# EAGLE design croky_b_1.7 mini (EAGLE 9.6.1)
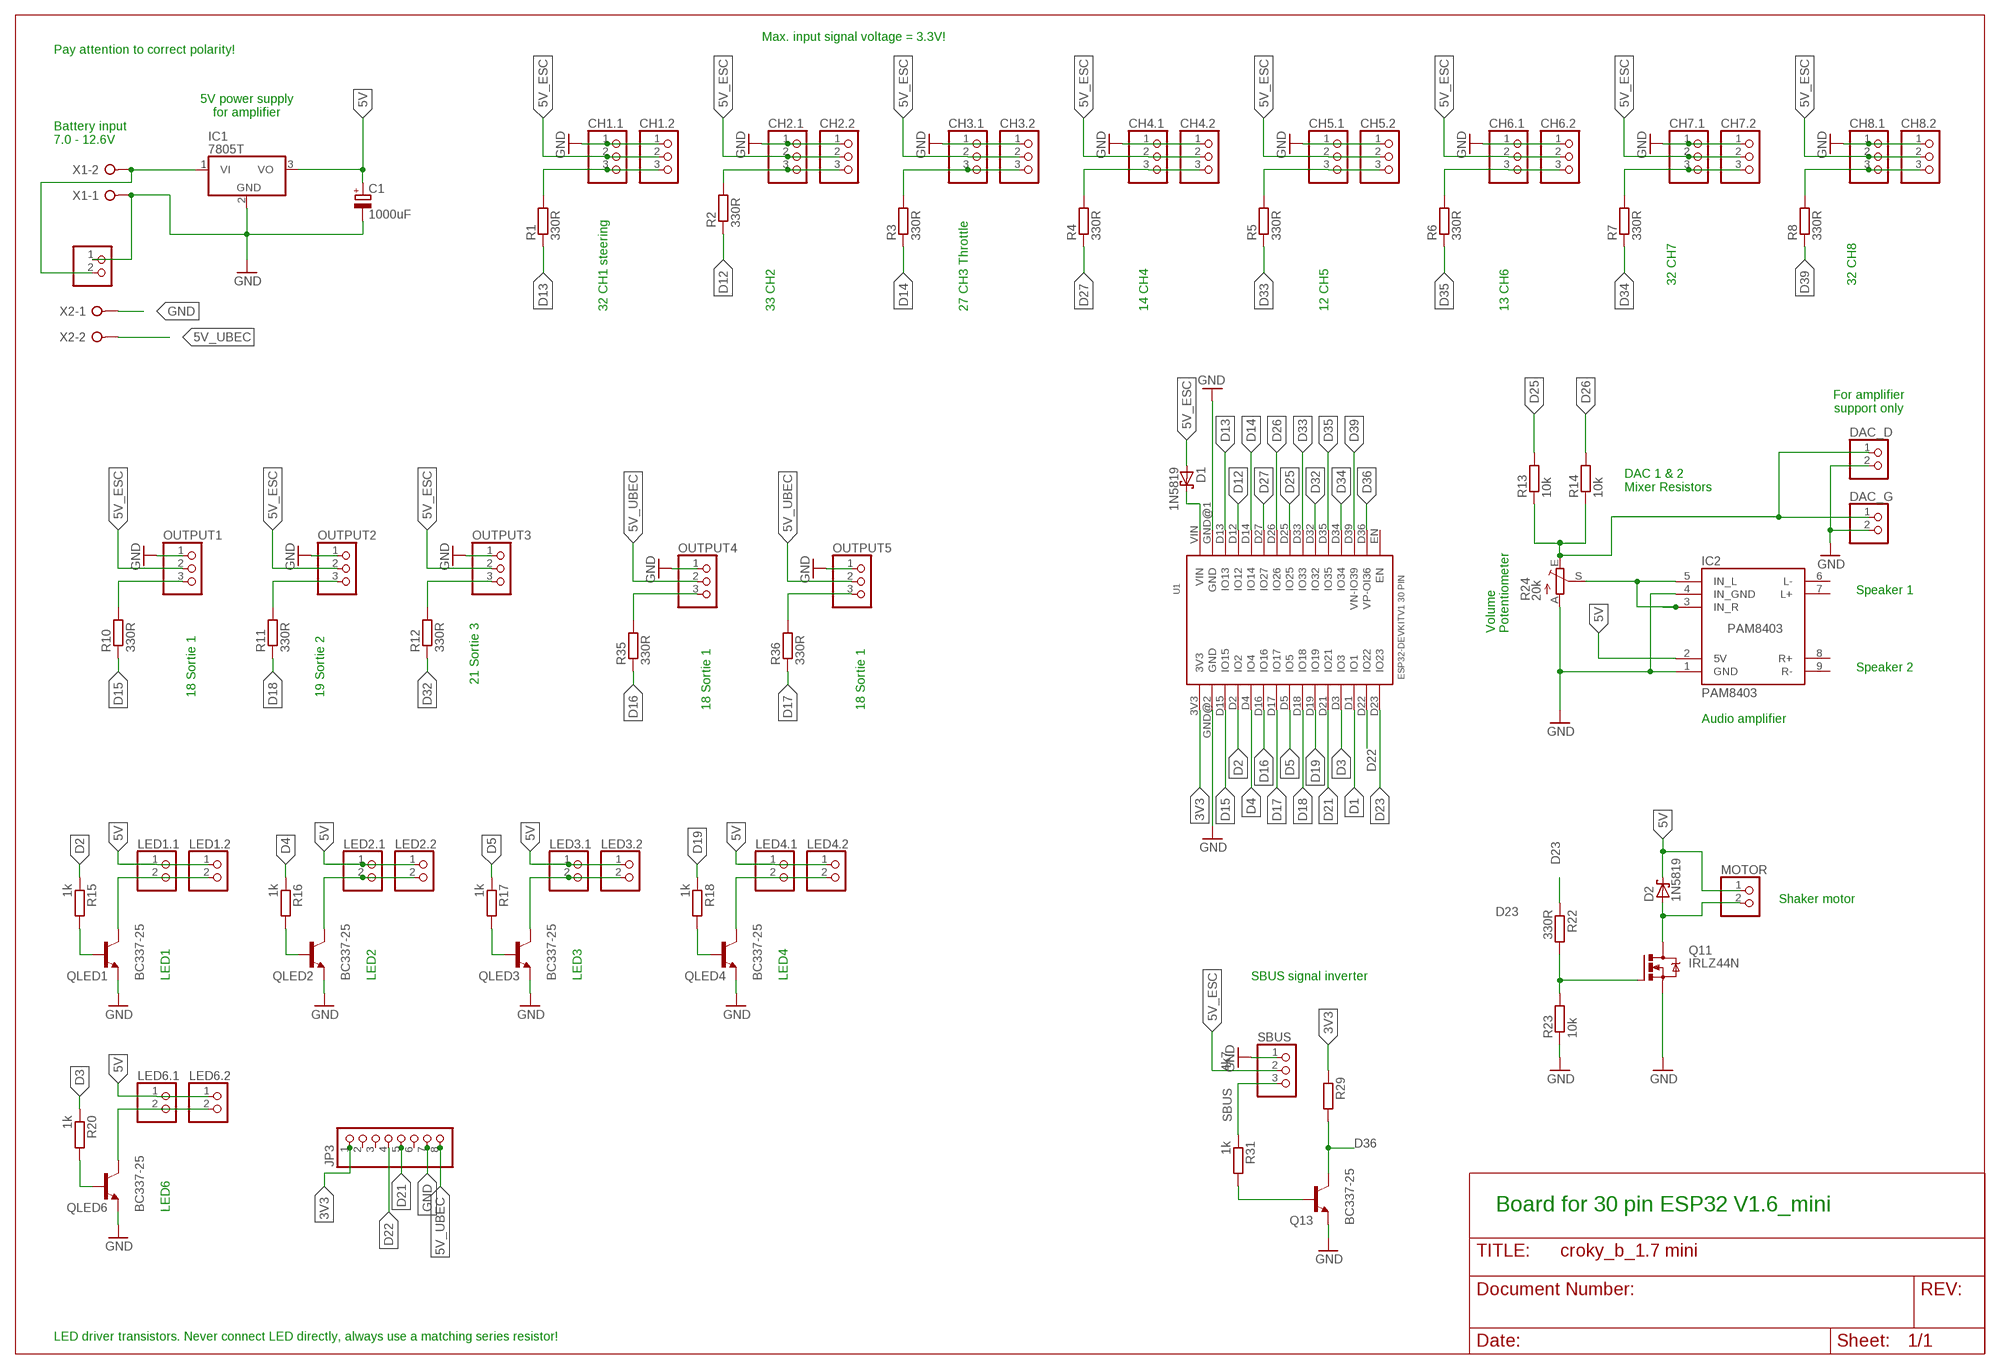
[diagram p0: schematic, sheet 1]

## Parts
C1  1000uF  CPOL-EUE5-10.5  [E5-10,5]
CH1.1  PINHD-1X3  [1X03]
CH1.2  PINHD-1X3  [1X03]
CH2.1  PINHD-1X3  [1X03]
CH2.2  PINHD-1X3  [1X03]
CH3.1  PINHD-1X3  [1X03]
CH3.2  PINHD-1X3  [1X03]
CH4.1  PINHD-1X3  [1X03]
CH4.2  PINHD-1X3  [1X03]
CH5.1  PINHD-1X3  [1X03]
CH5.2  PINHD-1X3  [1X03]
CH6.1  PINHD-1X3  [1X03]
CH6.2  PINHD-1X3  [1X03]
CH7.1  PINHD-1X3  [1X03]
CH7.2  PINHD-1X3  [1X03]
CH8.1  PINHD-1X3  [1X03]
CH8.2  PINHD-1X3  [1X03]
D1  1N5819  SCHOTTKY-DIODEDO35-7  [DO35-7]
D2  1N5819  SCHOTTKY-DIODEDO35-7  [DO35-7]
DAC_D  PINHD-1X2  [1X02]
DAC_G  PINHD-1X2  [1X02]
IC1  7805T  [TO220H]
IC2  PAM8403  [PAM8403]
JP3  PINHD-1X8  [1X08]
LED1.1  PINHD-1X2  [1X02]
LED1.2  PINHD-1X2  [1X02]
LED2.1  PINHD-1X2  [1X02]
LED2.2  PINHD-1X2  [1X02]
LED3.1  PINHD-1X2  [1X02]
LED3.2  PINHD-1X2  [1X02]
LED4.1  PINHD-1X2  [1X02]
LED4.2  PINHD-1X2  [1X02]
LED6.1  PINHD-1X2  [1X02]
LED6.2  PINHD-1X2  [1X02]
MOTOR  PINHD-1X2  [1X02]
MOTOR2  PINHD-1X2  [1X02]
OUTPUT1  PINHD-1X3  [1X03]
OUTPUT2  PINHD-1X3  [1X03]
OUTPUT3  PINHD-1X3  [1X03]
OUTPUT4  PINHD-1X3  [1X03]
OUTPUT5  PINHD-1X3  [1X03]
Q11  IRLZ44N  IRF540  [TO220BV]
Q13  BC337-25  [TO92]
QLED1  BC337-25  [TO92]
QLED2  BC337-25  [TO92]
QLED3  BC337-25  [TO92]
QLED4  BC337-25  [TO92]
QLED6  BC337-25  [TO92]
R1  330R  R-EU_0207/2V  [0207/2V]
R2  330R  R-EU_0207/2V  [0207/2V]
R3  330R  R-EU_0207/2V  [0207/2V]
R4  330R  R-EU_0207/2V  [0207/2V]
R5  330R  R-EU_0207/2V  [0207/2V]
R6  330R  R-EU_0207/2V  [0207/2V]
R7  330R  R-EU_0207/2V  [0207/2V]
R8  330R  R-EU_0207/2V  [0207/2V]
R10  330R  R-EU_0207/2V  [0207/2V]
R11  330R  R-EU_0207/2V  [0207/2V]
R12  330R  R-EU_0207/2V  [0207/2V]
R13  10k  R-EU_0207/10  [0207/10]
R14  10k  R-EU_0207/10  [0207/10]
R15  1k  R-EU_0207/2V  [0207/2V]
R16  1k  R-EU_0207/2V  [0207/2V]
R17  1k  R-EU_0207/2V  [0207/2V]
R18  1k  R-EU_0207/2V  [0207/2V]
R20  1k  R-EU_0207/2V  [0207/2V]
R22  330R  R-EU_0207/2V  [0207/2V]
R23  10k  R-EU_0207/2V  [0207/2V]
R24  20k  TRIM_EU-S64W  [S64W]
R29  4k7  R-EU_0207/2V  [0207/2V]
R31  1k  R-EU_0207/2V  [0207/2V]
R35  330R  R-EU_0207/2V  [0207/2V]
R36  330R  R-EU_0207/2V  [0207/2V]
SBUS  PINHD-1X3  [1X03]
U1  ESP32DEVKITV1  [ESP32-DEVKITV1]
X1  W237-02P  [W237-132]
X2  W237-02P  [W237-132]

## Nets
3V3: JP3.1 R29.1 U1.3V3
5V: C1.+ D2.C IC1.3(VO) IC2.2(5V) LED1.1.1 LED1.2.1 LED2.1.1 LED2.2.1 LED3.1.1 LED3.2.1 LED4.1.1 LED4.2.1 LED6.1.1 LED6.2.1 MOTOR.1
5V_ESC: CH1.1.2 CH1.2.2 CH2.1.2 CH2.2.2 CH3.1.2 CH3.2.2 CH4.1.2 CH4.2.2 CH5.1.2 CH5.2.2 CH6.1.2 CH6.2.2 CH7.1.2 CH7.2.2 CH8.1.2 CH8.2.2 D1.A OUTPUT1.2 OUTPUT2.2 OUTPUT3.2 SBUS.2
5V_UBEC: JP3.8 OUTPUT4.2 OUTPUT5.2 X2.2
-: LED2.1.2 LED2.2.2 QLED2.3(C)
--: LED3.1.2 LED3.2.2 QLED3.3(C)
BAT+: IC1.1(VI) MOTOR2.2 X1.2
D1: U1.D1(IO1)
D2: R15.1 U1.D2(IO2)
D3: R20.1 U1.D3(IO3)
D4: R16.1 U1.D4(IO4)
D5: R17.1 U1.D5(IO5)
D12: R2.1 U1.D12(IO12)
D13: R1.1 U1.D13(IO13)
D14: R3.1 U1.D14(IO14)
D15: R10.1 U1.D15(IO15)
D16: R35.1 U1.D16(IO16)
D17: R36.1 U1.D17(IO17)
D18: R11.1 U1.D18(IO18)
D19: R18.1 U1.D19(IO19)
D21: JP3.5 U1.D21(IO21)
D22: JP3.4 U1.D22(IO22)
D23: R22.1 U1.D23(IO23)
D25: R13.2 U1.D25(IO25)
D26: R14.2 U1.D26(IO26)
D27: R4.1 U1.D27(IO27)
D32: R12.1 U1.D32(IO32)
D33: R5.1 U1.D33(IO33)
D34: R7.1 U1.D34(IO34)
D35: R6.1 U1.D35(IO35)
D36: Q13.3(C) R29.2 U1.D36(VP-OI36)
D39: R8.1 U1.D39(VN-IO39)
GND: C1.- CH1.1.1 CH1.2.1 CH2.1.1 CH2.2.1 CH3.1.1 CH3.2.1 CH4.1.1 CH4.2.1 CH5.1.1 CH5.2.1 CH6.1.1 CH6.2.1 CH7.1.1 CH7.2.1 CH8.1.1 CH8.2.1 DAC_D.2 DAC_G.2 IC1.2(GND) IC2.1(GND) IC2.4(IN_GND) JP3.7 MOTOR2.1 OUTPUT1.1 OUTPUT2.1 OUTPUT3.1 OUTPUT4.1 OUTPUT5.1 Q11.S Q13.1(E) QLED1.1(E) QLED2.1(E) QLED3.1(E) QLED4.1(E) QLED6.1(E) R23.1 R24.A SBUS.1 U1.GND@1(GND) U1.GND@2(GND) X1.1 X2.1
N$1: IC2.3(IN_R) IC2.5(IN_L) R24.S
N$3: CH6.1.3 CH6.2.3 R6.2
N$4: Q11.G R22.2 R23.2
N$5: CH5.1.3 CH5.2.3 R5.2
N$6: CH4.1.3 CH4.2.3 R4.2
N$7: CH7.1.3 CH7.2.3 R7.2
N$8: CH3.1.3 CH3.2.3 R3.2
N$9: D1.C U1.VIN
N$10: CH1.1.3 CH1.2.3 R1.2
N$11: OUTPUT1.3 R10.2
N$12: OUTPUT2.3 R11.2
N$13: OUTPUT3.3 R12.2
N$14: CH2.1.3 CH2.2.3 R2.2
N$15: D2.A MOTOR.2 Q11.D
N$16: QLED1.2(B) R15.2
N$17: QLED6.2(B) R20.2
N$18: LED1.1.2 LED1.2.2 QLED1.3(C)
N$19: LED6.1.2 LED6.2.2 QLED6.3(C)
N$20: DAC_D.1 DAC_G.1 R13.1 R14.1 R24.E
N$22: QLED3.2(B) R17.2
N$24: QLED2.2(B) R16.2
N$29: QLED4.2(B) R18.2
N$30: LED4.1.2 LED4.2.2 QLED4.3(C)
N$37: Q13.2(B) R31.2
N$41: CH8.1.3 CH8.2.3 R8.2
N$49: OUTPUT4.3 R35.2
N$50: OUTPUT5.3 R36.2
SBUS: R31.1 SBUS.3
Unconnected: IC2.6(L-) IC2.7(L+) IC2.8(R+) IC2.9(R-) JP3.2 JP3.3 JP3.6 U1.EN

## Notes on the sheet
- Max. input signal voltage = 3.3V!
- Pay attention to correct polarity!
- 5V power supply
  for amplifier
- Battery input
  7.0 - 12.6V
- 32 CH7 | 32 CH8
- 32 CH1 steering | 33 CH2 | 27 CH3 Throttle | 14 CH4 | 12 CH5 | 13 CH6
- For amplifier
  support only
- DAC 1 & 2
  Mixer Resistors
- Speaker 1
- Volume
  Potentiometer
- Speaker 2
- 21 Sortie 3
- 18 Sortie 1 | 19 Sortie 2
- 18 Sortie 1 | 18 Sortie 1
- Audio amplifier
- Shaker motor
- LED1 | LED2 | LED3 | LED4 | SBUS signal inverter
- LED6 | Board for 30 pin ESP32 V1.6_mini
- LED driver transistors. Never connect LED directly, always use a matching series resistor!

## Library data of the parts
C1 = rcl:CPOL-EU: POLARIZED CAPACITOR, European symbol
CH1.1 CH1.2 CH2.1 CH2.2 CH3.1 CH3.2 CH4.1 CH4.2 CH5.1 CH5.2 CH6.1 CH6.2 CH7.1 CH7.2 CH8.1 CH8.2 OUTPUT1-OUTPUT5 SBUS = 00_custom_pinhead:PINHD-1X3: PIN HEADER
D1 D2 = diode:SCHOTTKY-DIODE: Schottky Diode
DAC_D DAC_G LED1.1 LED1.2 LED2.1 LED2.2 LED3.1 LED3.2 LED4.1 LED4.2 LED6.1 LED6.2 MOTOR MOTOR2 = 00_custom_pinhead:PINHD-1X2: PIN HEADER
IC1 = linear:78*: Positive VOLTAGE REGULATOR Source: http://cache.national.com/ds/LM/LM78L05.pdf http://www.fairchildsemi.com/ds/LM/LM7805.pdf
IC2 = 00_custom:PAM8403: 2Channel 3W DC 2.5-5V Class D Amplifier Board
JP3 = pinhead:PINHD-1X8: PIN HEADER
Q11 = transistor-power:IRF540: HEXFET Power MOSFET
Q13 QLED1-QLED4 QLED6 = transistor-npn:BC337*: NPN Transistor
R1 R2 R4-R8 R10-R18 R20 R22 R23 R29 R31 R35 R36 = rcl:R-EU_: RESISTOR, European symbol
R3 = rcl:R-EU_: RESISTOR, European symbol; SPICEPREFIX: R
R24 = pot:TRIM_EU-: POTENTIOMETER
U1 = ESP32-DEVKITV1_30pin:ESP32DEVKITV1
X1 X2 = con-wago-508:W237-02P: WAGO SREW CLAMP; OC_FARNELL: unknown; OC_NEWARK: unknown

## Net classes
0 5V: clearance 0.254 mm

## Board
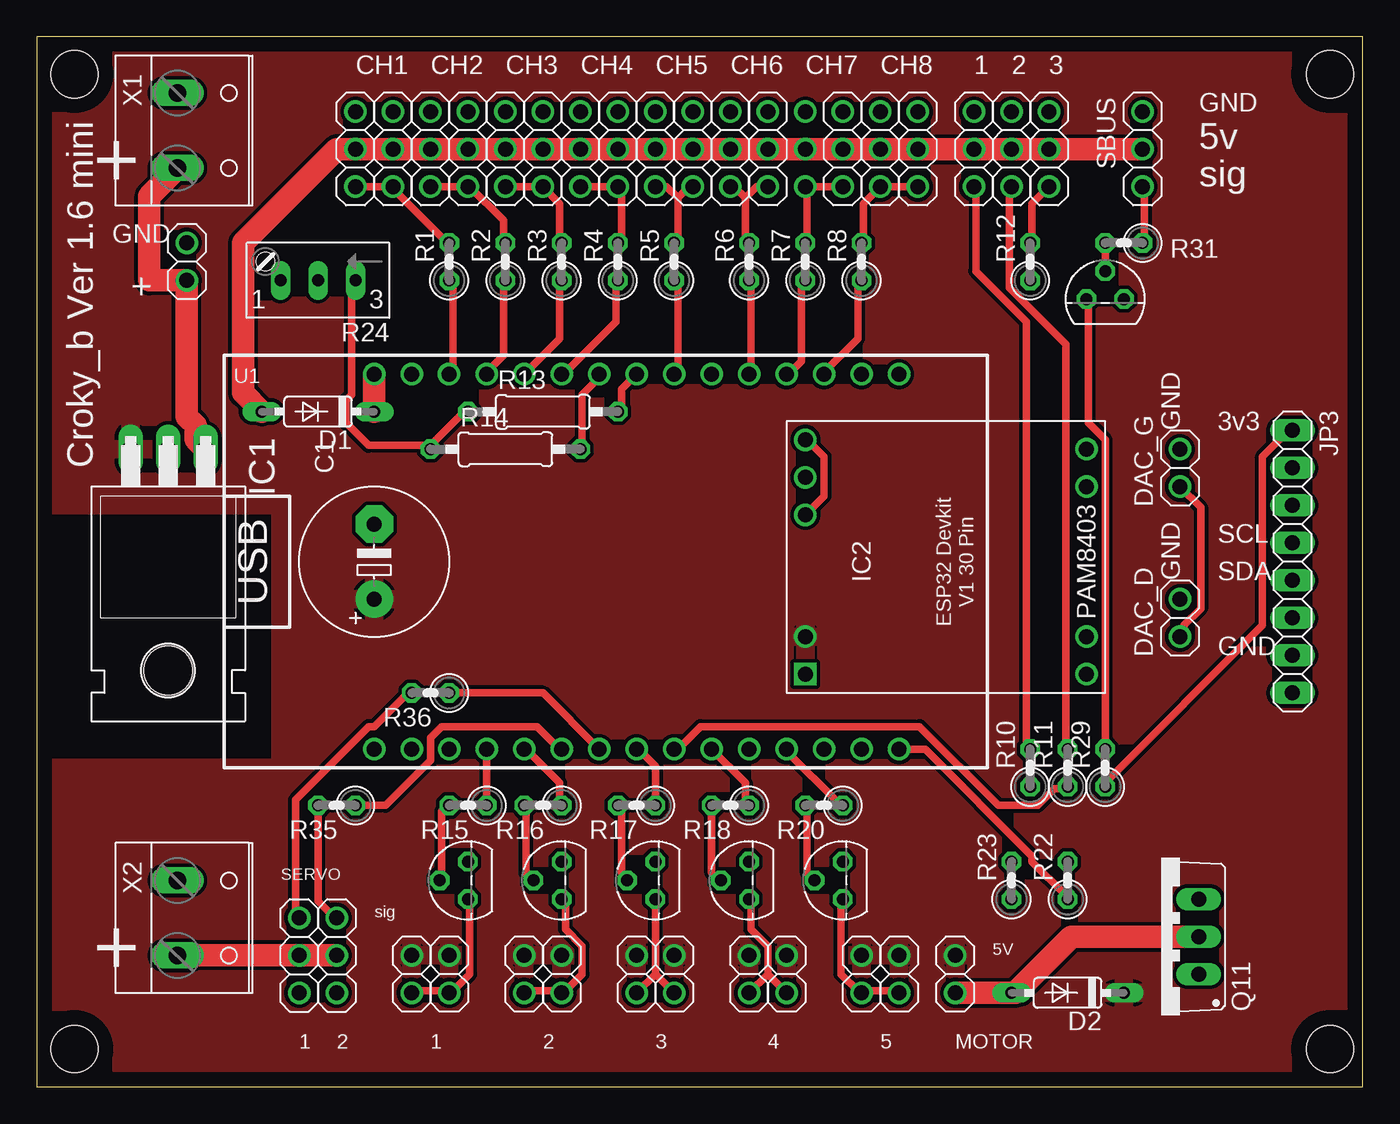
[diagram p1: board, top side]
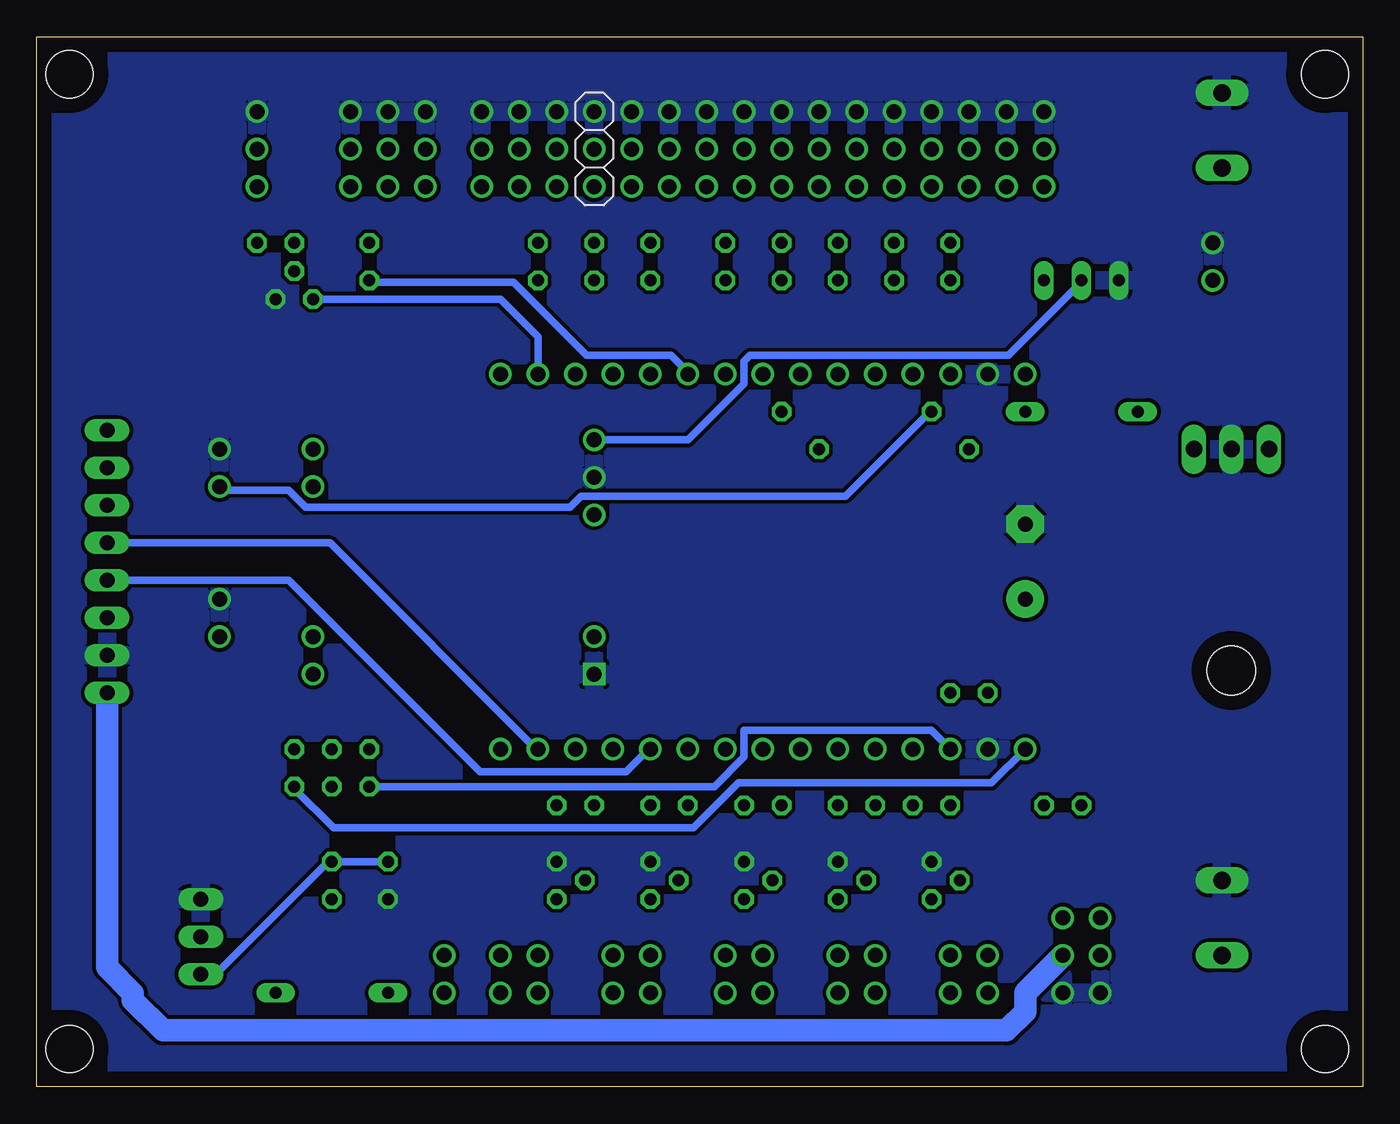
[diagram p2: board, bottom side, seen from below]

Size 89.84 x 71.11 mm. Coordinates in mm from the lower left corner, seen from the top.
Outline: 0,0 89.84,0 89.84,71.11 0,71.11 0,0
Copper layers (1*16): Top 0.035mm / dielectric 1.5mm / Bottom 0.035mm
Design rules "default *": minimum track width 20mil, minimum drill 0.35mm, track to track 6mil, track to pad 6mil, pad to pad 6mil, via to via 6mil, smd to smd 6mil, copper to edge 40mil, drill to drill 6mil, minimum pad ring 10mil, minimum via ring 8mil, stop-mask expansion 4mil, vias tented up to drill 0mil, thermal gap 10mil
Holes 3.2 mm at 2.54,68.58 2.54,68.58 2.54,2.54 2.54,2.54 87.63,2.54 87.63,2.54 87.63,68.58 87.63,68.58

### Footprints (pad centres in the part's own frame; a part is rotated, then mirrored left to right if it is on the bottom)
E5-10,5 = drill 1.016 pad 2.54: + -2.54,0 | drill 1.016 pad 2.54 octagon: - 2.54,0
1X03 = drill 1.016 pad 1.524: 1 -2.54,0; 2 0,0; 3 2.54,0
DO35-7 = drill 0.813 long: A 3.81,0; C -3.81,0
1X02 = drill 1.016 pad 1.524: 1 -1.27,0; 2 1.27,0
TO220H = drill 1.118 long: 1 -2.54,-10.16; 2 0,-10.16; 3 2.54,-10.16 | hole 3.302: 0,4.826
PAM8403 = drill 1.016 square: 1 -7.62,8.89 | drill 1.016: 2 -5.08,8.89; 3 3.175,8.89; 4 5.715,8.89; 5 8.255,8.89; 6 7.62,-10.16; 7 5.08,-10.16; 8 -5.08,-10.16; 9 -7.62,-10.16
1X08 = drill 1.016 long: 1 -8.89,0; 2 -6.35,0; 3 -3.81,0; 4 -1.27,0; 5 1.27,0; 6 3.81,0; 7 6.35,0; 8 8.89,0
TO220BV = drill 1.016 long: D 0,-2.54; G -2.54,-2.54; S 2.54,-2.54
TO92 = drill 0.813 octagon: 1 1.27,0; 2 0,1.905; 3 -1.27,0
0207/2V = drill 0.813 octagon: 1 -1.27,0; 2 1.27,0
0207/10 = drill 0.813 octagon: 1 -5.08,0; 2 5.08,0
S64W = drill 0.813 long: A 2.54,1.27; E -2.54,1.27; S 0,1.27
ESP32-DEVKITV1 = drill 1.016: 3V3 -16.51,-12.7; D1 13.97,-12.7; D2 -8.89,-12.7; D3 11.43,-12.7; D4 -6.35,-12.7; D5 1.27,-12.7; D12 -8.89,12.7; D13 -11.44,12.7; D14 -6.35,12.7; D15 -11.43,-12.7; D16 -3.81,-12.7; D17 -1.27,-12.7; D18 3.81,-12.7; D19 6.35,-12.7; D21 8.89,-12.7; D22 16.51,-12.7; D23 19.05,-12.7; D25 1.27,12.7; D26 -1.27,12.7; D27 -3.81,12.7; D32 6.35,12.7; D33 3.81,12.7; D34 11.43,12.7; D35 8.89,12.7; D36 16.51,12.7; D39 13.97,12.7; EN 19.05,12.7; GND@1 -13.97,12.7; GND@2 -13.97,-12.7; VIN -16.51,12.7
W237-132 = drill 1.194 long: 1 -2.54,-0.635; 2 2.54,-0.635

### Placement (x,y rotation side)
C1  22.86,35.56 90 top
CH1.1  21.59,63.5 270 top
CH1.2  24.13,63.5 270 top
CH2.1  26.67,63.5 270 top
CH2.2  29.21,63.5 270 top
CH3.1  31.75,63.5 270 top
CH3.2  34.29,63.5 270 top
CH4.1  36.83,63.5 270 top
CH4.2  39.37,63.5 270 top
CH5.1  41.91,63.5 270 top
CH5.2  44.45,63.5 270 top
CH6.1  46.99,63.5 270 top
CH6.2  49.53,63.5 270 top
CH7.1  52.07,63.5 270 bottom
CH7.2  54.61,63.5 270 top
CH8.1  57.15,63.5 270 top
CH8.2  59.69,63.5 270 top
D1  19.05,45.72 180 top
D2  69.85,6.35 180 top
DAC_D  77.47,31.75 90 top
DAC_G  77.47,41.91 90 top
IC1  8.89,33.02 180 top
IC2  60.96,35.56 90 top
JP3  85.09,35.56 270 top
LED1.1  27.94,7.62 270 top
LED1.2  25.4,7.62 270 top
LED2.1  33.02,7.62 270 top
LED2.2  35.56,7.62 270 top
LED3.1  40.64,7.62 270 top
LED3.2  43.18,7.62 270 top
LED4.1  48.26,7.62 270 top
LED4.2  50.8,7.62 270 top
LED6.1  55.88,7.62 270 top
LED6.2  58.42,7.62 270 top
MOTOR  62.23,7.62 270 top
MOTOR2  10.16,55.88 270 top
OUTPUT1  63.5,63.5 270 top
OUTPUT2  66.04,63.5 270 top
OUTPUT3  68.58,63.5 270 top
OUTPUT4  20.32,8.89 90 top
OUTPUT5  17.78,8.89 90 top
Q11  76.2,10.16 90 top
Q13  72.39,53.34 0 top
QLED1  29.21,13.97 90 top
QLED2  35.56,13.97 90 top
QLED3  41.91,13.97 90 top
QLED4  48.26,13.97 90 top
QLED6  54.61,13.97 90 top
R1  27.94,55.88 90 top
R2  31.75,55.88 90 top
R3  35.56,55.88 90 top
R4  39.37,55.88 90 top
R5  43.18,55.88 90 top
R6  48.26,55.88 90 top
R7  52.07,55.88 90 top
R8  55.88,55.88 90 top
R10  67.31,21.59 90 top
R11  69.85,21.59 90 top
R12  67.31,55.88 90 top
R13  34.29,45.72 0 top
R14  31.75,43.18 0 top
R15  29.21,19.05 180 top
R16  34.29,19.05 180 top
R17  40.64,19.05 180 top
R18  46.99,19.05 180 top
R20  53.34,19.05 180 top
R22  69.85,13.97 90 top
R23  66.04,13.97 90 top
R24  19.05,55.88 180 top
R29  72.39,21.59 90 top
R31  73.66,57.15 180 top
R35  20.32,19.05 180 top
R36  26.67,26.67 180 top
SBUS  74.93,63.5 270 top
U1  39.37,35.56 0 top
X1  10.16,64.77 270 top
X2  10.16,11.43 270 top

### Tracks (layer width: path | path; a pad name or v marks a point on that pad's centre or on a via)
3V3
  Top 0.508: R29.1 72.39,20.57 83.06,31.24 83.06,42.67 84.84,44.45 JP3.1
  Bottom 0.508: U1.3V3 25.15,20.57 42.29,20.57 45.34,17.53 69.72,17.53 72.39,20.19 R29.1
5V
  pour Top: 0,72.39 95.25,72.39 95.25,1.27 0,1.27 0,21.59 16.51,21.59 16.51,39.37 0,39.37
5V_ESC
  Top 1.524: D1.A 13.97,46.99 13.97,57.15 20.32,63.5 CH1.1.2 CH1.2.2 CH2.1.2 CH2.2.2 CH3.1.2 CH3.2.2 CH4.1.2 CH4.2.2 CH5.1.2 CH5.2.2 CH6.1.2 CH6.2.2 CH7.1.2 CH7.2.2 CH8.1.2 CH8.2.2 OUTPUT1.2 OUTPUT2.2 OUTPUT3.2 SBUS.2
5V_UBEC
  Top 1.524: OUTPUT4.2 OUTPUT5.2 X2.2
  Bottom 1.524: OUTPUT4.2 22.86,6.35 22.86,5.08 24.13,3.81 81.28,3.81 83.33,5.86 83.33,6.33 85.09,8.09 JP3.8
-
  Top 0.508: QLED2.3 35.81,12.57 35.81,10.67 36.96,9.53 36.96,7.62 35.81,6.48 LED2.2.2 35.43,6.48 33.15,6.48 LED2.1.2
--
  Top 0.508: 41.91,7.62 QLED3.3 | LED3.1.2 41.91,7.62 | 41.91,7.62 LED3.2.2
BAT+
  Top 1.524: IC1.1 10.74,43.87 10.74,44.79 10.16,45.37 MOTOR2.2 7.62,54.61 7.62,60.33 X1.2
D2
  Top 0.508: U1.D2 R15.1
D3
  Top 0.508: R20.1 54.48,19.05 50.67,22.86 U1.D3
D4
  Top 0.508: R16.1 35.43,19.05 35.43,20.57 33.15,22.86 U1.D4
D5
  Top 0.508: R17.1 41.91,21.72 40.77,22.86 U1.D5
D12
  Top 0.508: R2.1 31.62,54.48 31.62,49.53 30.48,48.39 U1.D12
D13
  Top 0.508: R1.1 28.19,54.48 28.19,48.39 U1.D13
D14
  Top 0.508: U1.D14 35.43,50.67 35.43,54.48 R3.1
D15
  Bottom 0.508: U1.D15 29.21,24.13 41.91,24.13 41.91,22.33 43.92,20.32 R10.1
D16
  Top 0.508: R35.1 23.62,19.05 26.67,22.1 26.67,23.62 27.43,24.38 33.91,24.38 35.43,22.86 U1.D16
D17
  Top 0.508: R36.1 34.29,26.67 U1.D17
D18
  Top 0.508: R11.1 69.72,20.19 68.96,20.19 67.82,19.05 65.15,19.05 59.82,24.38 44.96,24.38 43.43,22.86 U1.D18
D19
  Top 0.508: U1.D19 48.01,20.57 48.01,19.05 R18.1
D21
  Bottom 0.508: U1.D21 48.39,22.86 49.91,21.34 59.82,21.34 72.77,34.29 JP3.5
D22
  Bottom 0.508: U1.D22 56.01,22.86 69.98,36.83 JP3.4
D23
  Top 0.508: U1.D23 60.2,22.86 67.44,15.62 67.44,15.24 69.72,12.95 R22.1
D25
  Top 0.508: U1.D25 39.62,47.24 39.62,45.72 R13.2
D26
  Top 0.508: R14.2 36.96,43.43 36.96,46.86 38.1,48.01 U1.D26
D27
  Top 0.508: R4.1 39.24,54.48 39.24,51.82 35.81,48.39 U1.D27
D32
  Bottom 0.508: R12.1 67.06,54.48 57.53,54.48 52.58,49.53 46.86,49.53 45.72,48.39 U1.D32
D33
  Top 0.508: R5.1 43.43,54.48 43.43,48.39 U1.D33
D34
  Top 0.508: R7.1 51.82,54.48 51.82,49.15 51.05,48.39 U1.D34
D35
  Top 0.508: R6.1 48.39,54.48 48.39,48.39 U1.D35
D36
  Top 0.508: R29.2 72.39,43.81 71.25,44.96 71.25,53.34 Q13.3
  Bottom 0.508: U1.D36 55.88,50.8 58.42,53.34 Q13.3
D39
  Top 0.508: R8.1 55.63,54.48 55.63,50.67 53.34,48.39 U1.D39
GND
  pour Bottom: 0,72.39 0,-2.54 93.98,-2.54 93.98,72.39
N$1
  Top 0.508: IC2.3 53.34,40 53.34,42.67 52.2,43.81 IC2.5
  Bottom 0.508: IC2.5 45.72,43.81 41.91,47.62 41.91,49.15 41.53,49.53 24,49.53 19.05,54.48 R24.S
N$3
  Top 0.508: 48.01,60.2 48.01,57.15 R6.2 | 48.01,60.2 47.24,60.96 CH6.1.3 | CH6.2.3 48.77,60.96 48.01,60.2
N$4
  Bottom 0.508: R23.2 R22.2 70.1,15.24 77.72,7.62 Q11.G
N$5
  Top 0.508: 43.43,60.2 43.43,57.15 R5.2 | 43.43,60.2 44.2,60.96 CH5.2.3 | CH5.1.3 42.67,60.96 43.43,60.2
N$6
  Top 0.508: R4.2 39.62,57.15 39.62,60.96 CH4.2.3 CH4.1.3
N$7
  Top 0.508: 52.2,60.96 52.2,57.15 R7.2 | 52.2,60.96 CH7.2.3 | 52.2,60.96 CH7.1.3
N$8
  Top 0.508: R3.2 35.43,57.15 35.43,59.82 CH3.2.3 CH3.1.3
N$9
  Top 1.524: U1.VIN D1.C
N$10
  Top 0.508: 24,60.96 27.81,57.15 R1.2 | 24,60.96 CH1.1.3 | 24,60.96 CH1.2.3
N$11
  Top 0.508: R10.2 67.06,22.86 67.06,51.82 63.63,55.24 63.63,60.96 OUTPUT1.3
N$12
  Top 0.508: R11.2 69.72,22.86 69.72,50.29 65.91,54.1 65.91,60.96 OUTPUT2.3
N$13
  Top 0.508: OUTPUT3.3 67.44,59.82 67.44,57.15 R12.2
N$14
  Top 0.508: R2.2 31.62,57.15 31.62,58.67 29.34,60.96 CH2.2.3 CH2.1.3
N$15
  Top 0.508: 69.85,9.91 78.49,9.91 Q11.D
  Top 1.524: MOTOR.2 D2.A 66.29,6.35 69.85,9.91 70.1,10.16 Q11.D
N$16
  Top 0.508: QLED1.2 27.43,14.1 27.43,18.67 27.81,19.05 R15.2
N$17
  Top 0.508: QLED6.2 52.2,14.48 52.2,19.05 R20.2
N$18
  Top 0.508: QLED1.3 29.34,12.57 29.34,7.62 28.19,6.48 LED1.1.2 27.81,6.48 25.53,6.48 LED1.2.2
N$19
  Top 0.508: QLED6.3 54.48,12.57 54.48,7.62 55.63,6.48 LED6.1.2 56.01,6.48 58.29,6.48 LED6.2.2
N$20
  Top 0.508: DAC_G.1 78.87,39.24 78.87,32.38 77.72,31.24 77.72,30.48 DAC_D.1 | 26.67,43.43 28.96,45.72 R13.1 | 26.67,43.43 22.48,43.43 20.95,44.96 20.95,46.48 21.34,46.86 21.34,54.48 R24.E | 26.67,43.43 R14.1
  Bottom 0.508: DAC_G.1 77.34,40.39 72.77,40.39 71.63,39.24 53.72,39.24 52.96,40 35.05,40 29.34,45.72 R13.1
N$22
  Top 0.508: R17.2 39.62,19.05 39.62,14.48 40.01,14.1 QLED3.2
N$24
  Top 0.508: QLED2.2 33.15,14.48 33.15,19.05 R16.2
N$29
  Top 0.508: R18.2 45.72,14.48 46.1,14.1 QLED4.2
N$30
  Top 0.508: 49.53,7.62 49.53,9.53 48.39,10.67 48.39,12.57 QLED4.3 | LED4.1.2 49.53,7.62 | 49.53,7.62 LED4.2.2
N$37
  Top 0.508: R31.2 Q13.2
N$41
  Top 0.508: R8.2 56.01,57.15 56.01,59.82 CH8.1.3 CH8.2.3
N$49
  Top 0.508: R35.2 19.05,12.57 20.19,11.43 OUTPUT4.3
N$50
  Top 0.508: R36.2 25.15,26.67 22.86,24.38 22.48,24.38 17.53,19.43 17.53,11.43 OUTPUT5.3
SBUS
  Top 0.508: R31.1 75.06,57.15 75.06,60.96 SBUS.3

### Text on the board
tPlace: CH1 | CH2 | CH3 | CH4 | CH5 | CH6 | CH7 | CH8 | 1 | 2 | 3 | GND | 5v | + | sig | GND | + | GND | 3v3 | Croky_b Ver 1.6 mini | SCL | GND | SDA | GND | SERVO | sig | 5V | + | 1 | 2 | 1 | 2 | 3 | 4 | 5 | MOTOR | 5v | GND